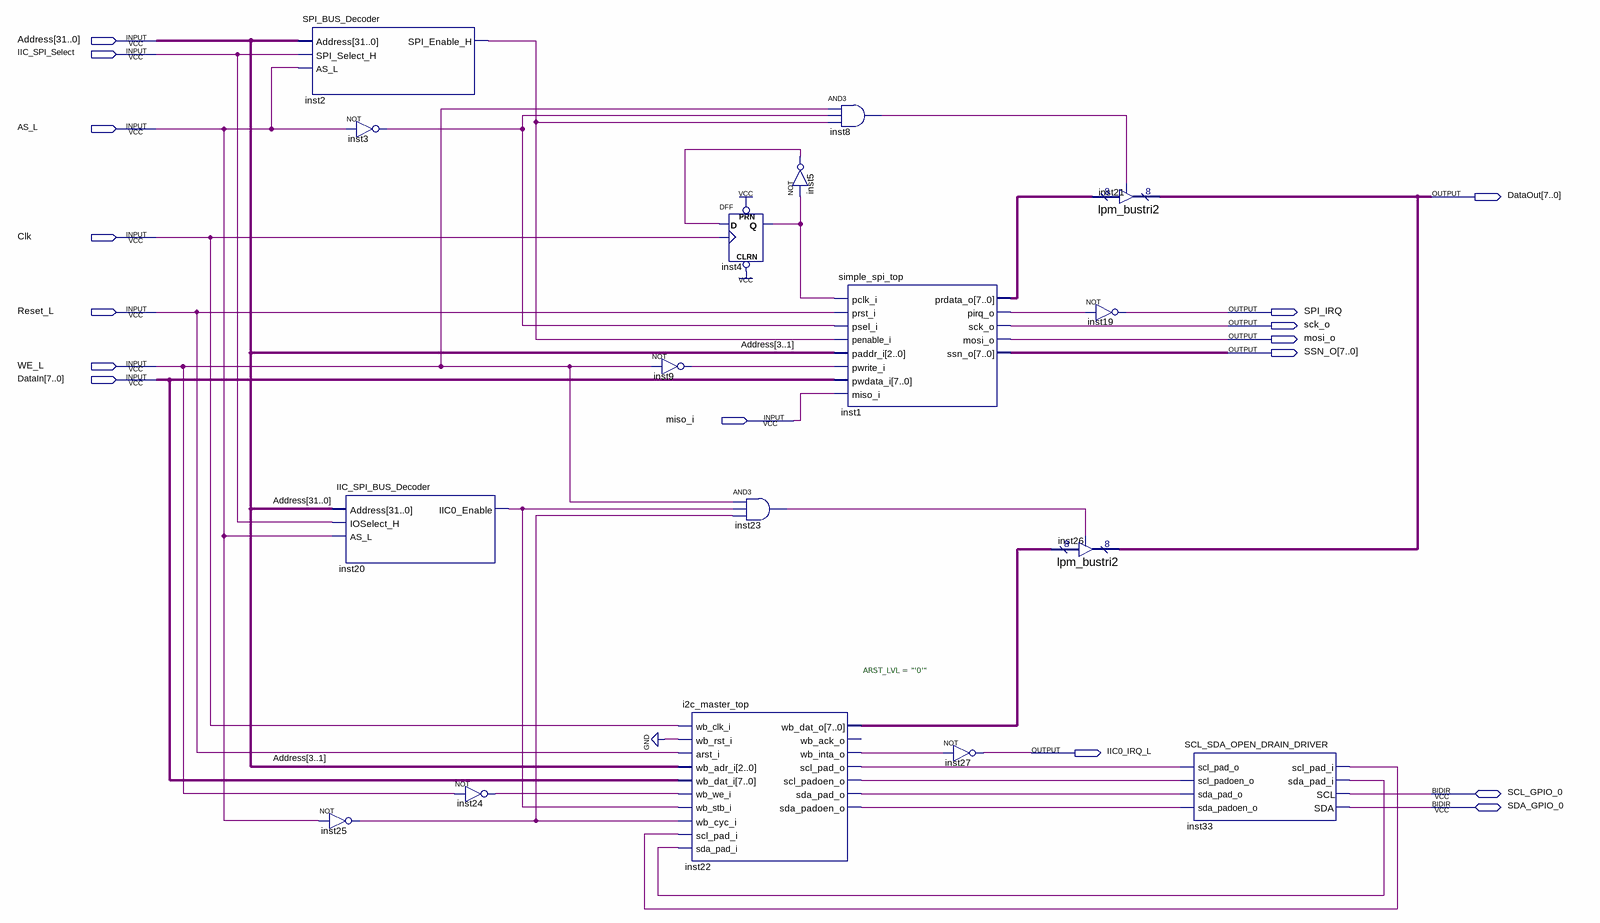
[diagram p0: schematic sheet]
// Quartus schematic IIC_SPI_Interface.bdf as structural Verilog: 17 symbols, 16 pins
module IIC_SPI_Interface (
  input  [31:0] Address,
  input  IIC_SPI_Select,
  input  AS_L,
  input  Clk,
  input  Reset_L,
  input  WE_L,
  input  [7:0] DataIn,
  input  miso_i,
  inout  SCL_GPIO_0,
  inout  SDA_GPIO_0,
  output [7:0] DataOut,
  output SPI_IRQ,
  output sck_o,
  output mosi_o,
  output [7:0] SSN_O,
  output IIC0_IRQ_L
);

  wire inst1_pirq_o, inst2_spi_enable_h, inst3_out, inst4_q, inst5_out, inst8_out, inst9_out,
       inst20_iic0_enable, inst22_scl_pad_o, inst22_scl_padoen_o, inst22_sda_pad_o, inst22_sda_padoen_o,
       inst22_wb_inta_o, inst23_out, inst24_out, inst25_out, inst33_scl_pad_i, inst33_sda_pad_i;
  wire [7:0] inst1_prdata_o, inst22_wb_dat_o;

  SPI_BUS_Decoder inst2 (
    .Address(Address), .SPI_Select_H(IIC_SPI_Select), .AS_L(AS_L), .SPI_Enable_H(inst2_spi_enable_h));
  not inst3 (inst3_out, AS_L);
  IIC_SPI_BUS_Decoder inst20 (
    .Address(Address), .IOSelect_H(IIC_SPI_Select), .AS_L(AS_L), .IIC0_Enable(inst20_iic0_enable));
  not inst25 (inst25_out, AS_L);
  not inst24 (inst24_out, WE_L);
  not inst9 (inst9_out, WE_L);
  i2c_master_top #(.ARST_LVL("'0'")) inst22 (
    .wb_clk_i(Clk), .wb_rst_i(1'b0), .arst_i(Reset_L), .wb_adr_i(Address[3:1]), .wb_dat_i(DataIn),
    .wb_we_i(inst24_out), .wb_stb_i(inst20_iic0_enable), .wb_cyc_i(inst25_out), .scl_pad_i(inst33_scl_pad_i),
    .sda_pad_i(inst33_sda_pad_i), .wb_dat_o(inst22_wb_dat_o), .wb_inta_o(inst22_wb_inta_o),
    .scl_pad_o(inst22_scl_pad_o), .scl_padoen_o(inst22_scl_padoen_o), .sda_pad_o(inst22_sda_pad_o),
    .sda_padoen_o(inst22_sda_padoen_o));  // open: wb_ack_o
  DFF inst4 (.CLRN(1'b1), .CLK(Clk), .D(inst5_out), .PRN(1'b1), .Q(inst4_q));
  and inst23 (inst23_out, WE_L, inst20_iic0_enable, inst25_out);
  not inst5 (inst5_out, inst4_q);
  and inst8 (inst8_out, WE_L, inst3_out, inst2_spi_enable_h);
  simple_spi_top inst1 (
    .pclk_i(inst4_q), .prst_i(Reset_L), .psel_i(inst3_out), .penable_i(inst2_spi_enable_h),
    .paddr_i(Address[3:1]), .pwrite_i(inst9_out), .pwdata_i(DataIn), .miso_i(miso_i),
    .prdata_o(inst1_prdata_o), .pirq_o(inst1_pirq_o), .sck_o(sck_o), .mosi_o(mosi_o), .ssn_o(SSN_O));
  not inst27 (IIC0_IRQ_L, inst22_wb_inta_o);
  lpm_bustri2 inst26 (.enabledt(inst23_out), .data(inst22_wb_dat_o), .tridata(DataOut));
  lpm_bustri2 inst21 (.enabledt(inst8_out), .data(inst1_prdata_o), .tridata(DataOut));
  not inst19 (SPI_IRQ, inst1_pirq_o);
  SCL_SDA_OPEN_DRAIN_DRIVER inst33 (
    .scl_pad_o(inst22_scl_pad_o), .scl_padoen_o(inst22_scl_padoen_o), .sda_pad_o(inst22_sda_pad_o),
    .sda_padoen_o(inst22_sda_padoen_o), .scl_pad_i(inst33_scl_pad_i), .sda_pad_i(inst33_sda_pad_i),
    .SCL(SCL_GPIO_0), .SDA(SDA_GPIO_0));
endmodule
